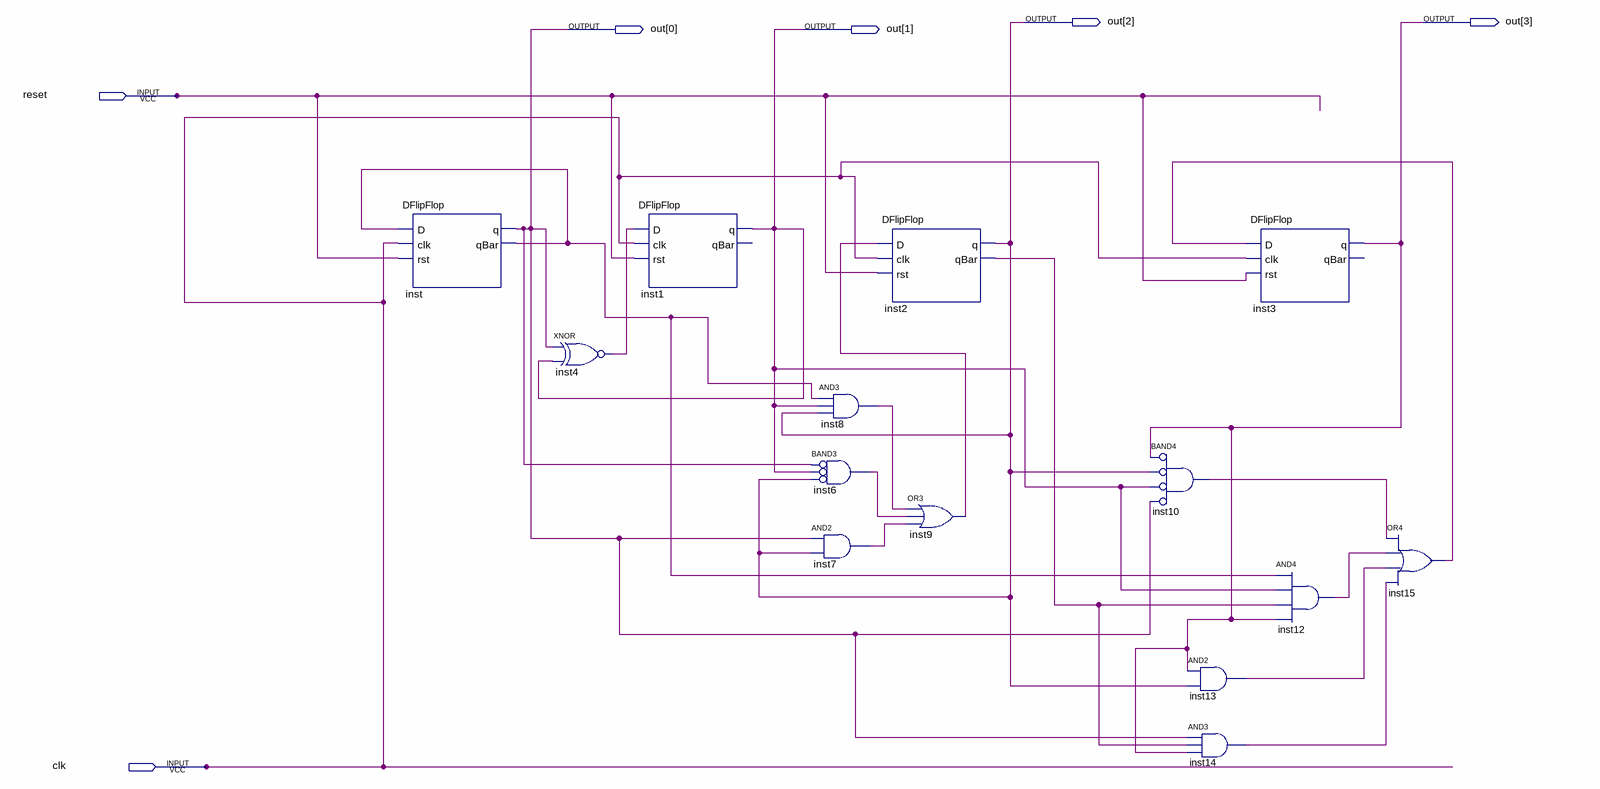
[diagram p0: schematic sheet]
// Quartus schematic countDownBlock.bdf as structural Verilog: 14 symbols, 6 pins
module countDownBlock (
  input  reset,
  input  clk,
  output [3:0] out
);

  wire inst2_qbar, inst4_out, inst6_out, inst7_out, inst8_out, inst9_out, inst10_out, inst12_out, inst13_out,
       inst14_out, inst15_out, inst_qbar;

  DFlipFlop inst (.D(inst_qbar), .clk(clk), .rst(reset), .q(out[0]), .qBar(inst_qbar));
  xnor inst4 (inst4_out, out[0], out[1]);
  DFlipFlop inst1 (.D(inst4_out), .clk(clk), .rst(reset), .q(out[1]));  // open: qBar
  and inst8 (inst8_out, inst_qbar, out[1], out[2]);
  and inst6 (inst6_out, ~out[0], ~out[1], ~out[2]);  // BAND3
  and inst7 (inst7_out, out[0], out[2]);
  DFlipFlop inst2 (.D(inst9_out), .clk(clk), .rst(reset), .q(out[2]), .qBar(inst2_qbar));
  or inst9 (inst9_out, inst8_out, inst6_out, inst7_out);
  and inst10 (inst10_out, ~out[3], ~out[2], ~out[1], ~out[0]);  // BAND4
  and inst13 (inst13_out, out[3], out[2]);
  and inst14 (inst14_out, out[0], inst2_qbar, out[3]);
  DFlipFlop inst3 (.D(inst15_out), .clk(clk), .rst(reset), .q(out[3]));  // open: qBar
  and inst12 (inst12_out, inst_qbar, out[1], inst2_qbar, out[3]);
  or inst15 (inst15_out, inst10_out, inst12_out, inst13_out, inst14_out);
endmodule
